# Altium schematic sheet PRO3.SchDoc
size A4
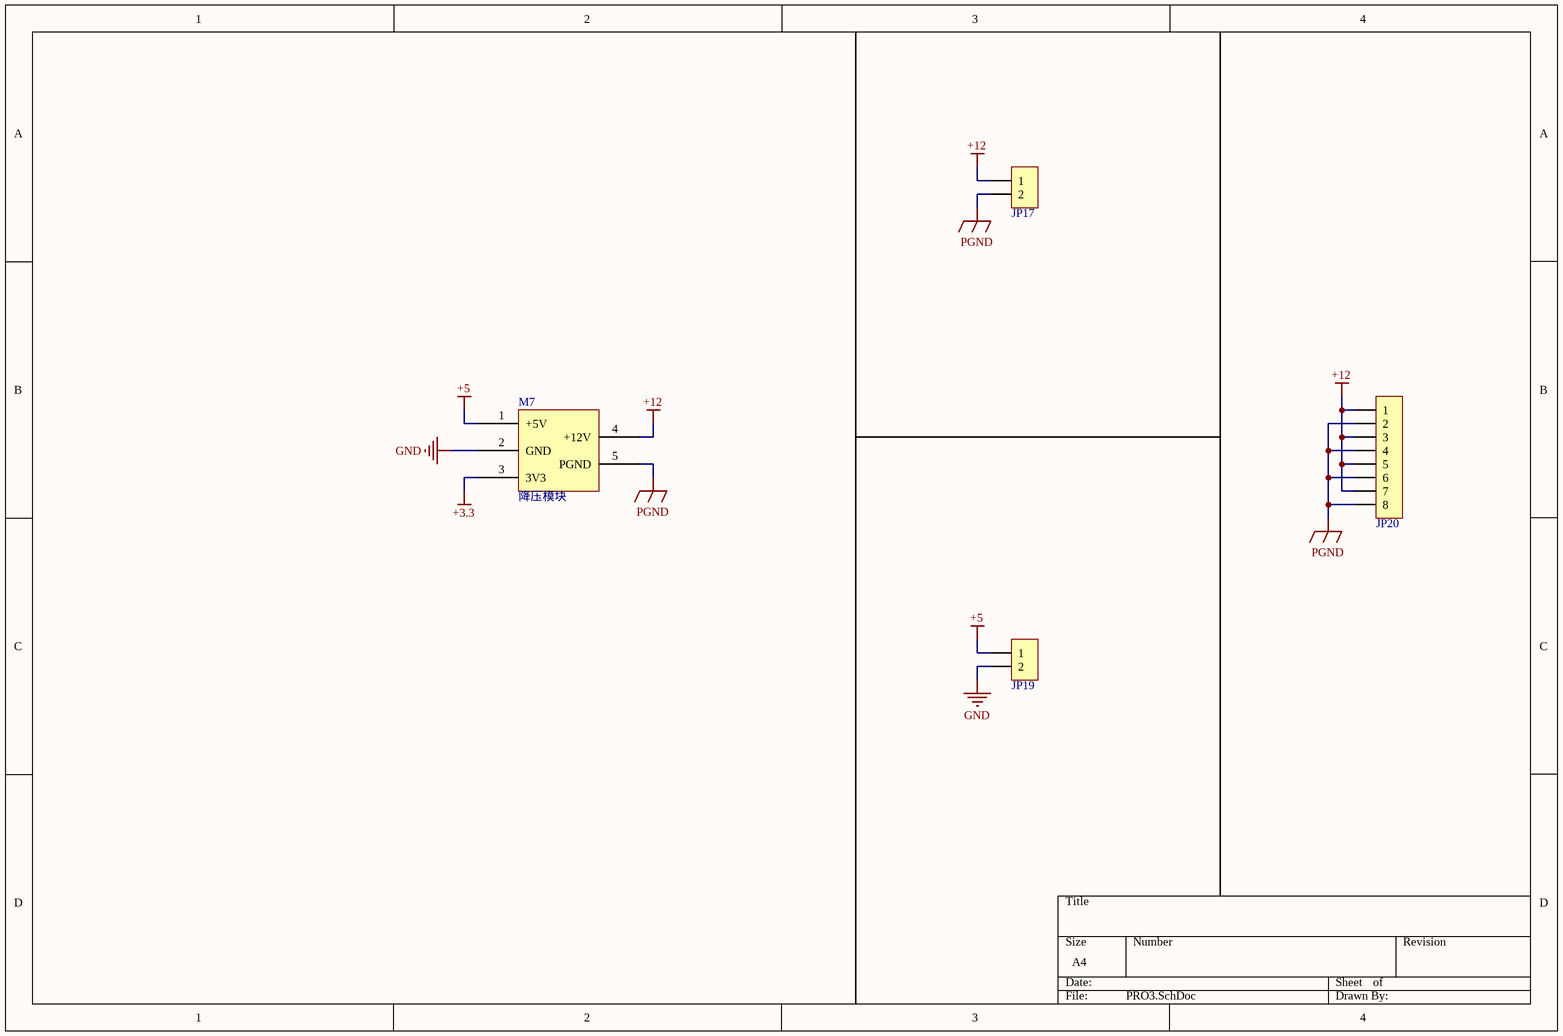
[diagram p0: PRO3.SchDoc]

## Parts
JP17  HDR-1X2  [KF128-5.08-2P]  (value not drawn)
JP19  HDR-1X2  [KF128-5.08-2P]  (value not drawn)
JP20  HDR-1X8  [KF128-5.08-8P]  (value not drawn)
M7  降压模块  [一号电压板]

## Nets
+3.3: M7.3(3V3)
+5: JP19.1 M7.1(+5V)
+12: JP17.1 JP20.1 JP20.3 JP20.5 JP20.7 M7.4(+12V)
GND: JP19.2 M7.2(GND)
PGND: JP17.2 JP20.2 JP20.4 JP20.6 JP20.8 M7.5(PGND)

## Library data of the parts
JP17 JP19 = Header 2: 2P接插件; 版权归属: 源创客; BOM名称: 2P接插件; 学习资源: www.ooocke.com
JP20 = Header 8: 8P接插件; 版权归属: 源创客; BOM名称: 8P接插件; 学习资源: www.ooocke.com
M7 = 一号电压板